# EAGLE schematic 1st_mixer_bpf_switch (EAGLE 7.2.0)
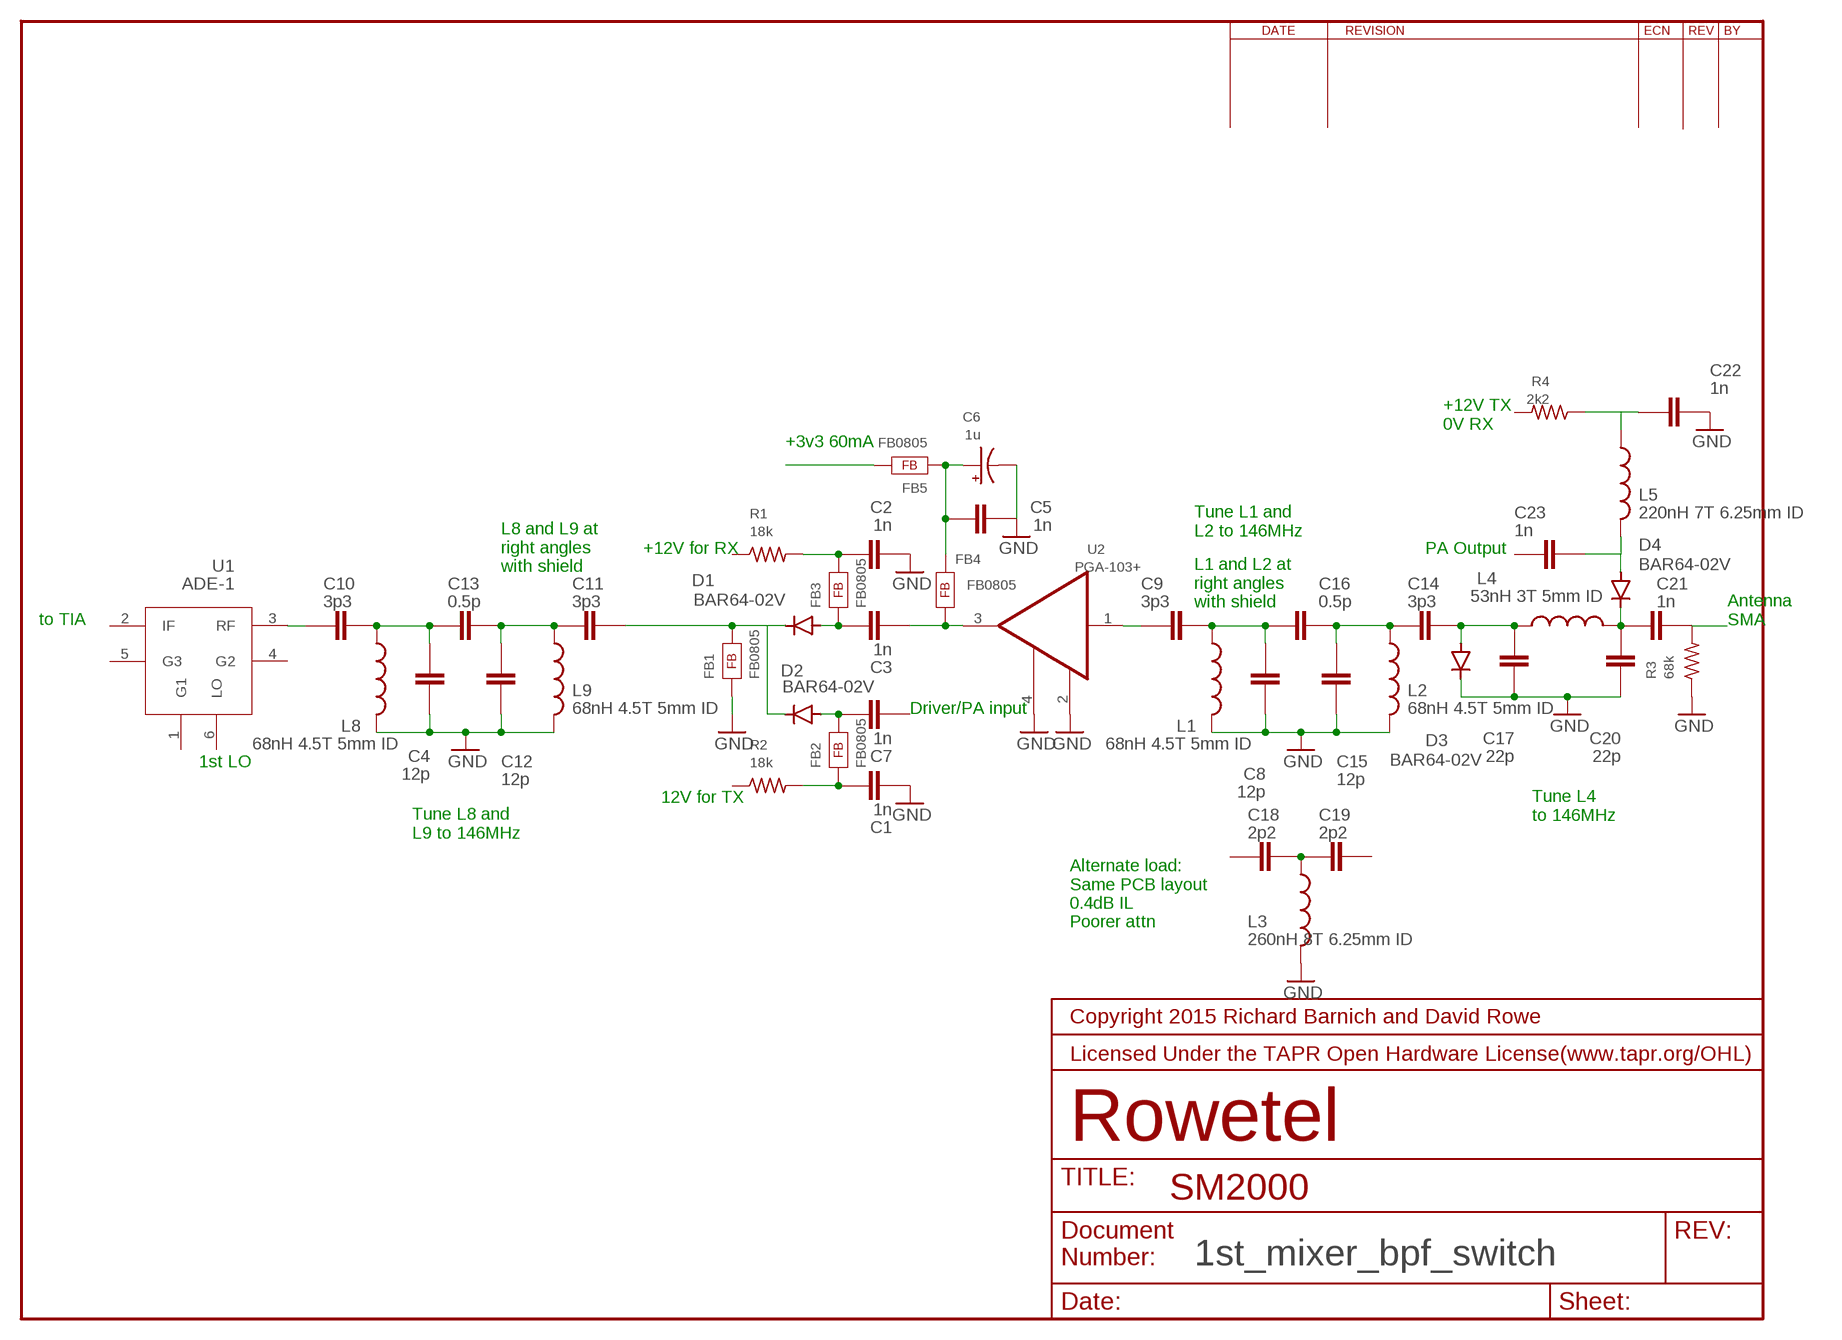
[diagram p0: schematic, sheet 1]

## Parts
C1  1n  CAPACITOR_0805  [CAPC2012X145AN]
C2  1n  CAPACITOR_0805  [CAPC2012X145AN]
C3  1n  CAPACITOR_0805  [CAPC2012X145AN]
C4  12p  CAPACITOR_0805  [CAPC2012X145AN]
C5  1n  CAPACITOR_0805  [CAPC2012X145AN]
C6  1u  CAP-TANT-1206  [C1206-TANT]
C7  1n  CAPACITOR_0805  [CAPC2012X145AN]
C8  12p  CAPACITOR_0805  [CAPC2012X145AN]
C9  3p3  CAPACITOR_0805  [CAPC2012X145AN]
C10  3p3  CAPACITOR_0805  [CAPC2012X145AN]
C11  3p3  CAPACITOR_0805  [CAPC2012X145AN]
C12  12p  CAPACITOR_0805  [CAPC2012X145AN]
C13  0.5p  CAPACITOR_0805  [CAPC2012X145AN]
C14  3p3  CAPACITOR_0805  [CAPC2012X145AN]
C15  12p  CAPACITOR_0805  [CAPC2012X145AN]
C16  0.5p  CAPACITOR_0805  [CAPC2012X145AN]
C17  22p  CAPACITOR_0805  [CAPC2012X145AN]
C18  2p2  CAPACITOR_0805  [CAPC2012X145AN]
C19  2p2  CAPACITOR_0805  [CAPC2012X145AN]
C20  22p  CAPACITOR_0805  [CAPC2012X145AN]
C21  1n  CAPACITOR_0805  [CAPC2012X145AN]
C22  1n  CAPACITOR_0805  [CAPC2012X145AN]
C23  1n  CAPACITOR_0805  [CAPC2012X145AN]
D1  BAR64-02V  [SC79_INFINEON]
D2  BAR64-02V  [SC79_INFINEON]
D3  BAR64-02V  [SC79_INFINEON]
D4  BAR64-02V  [SC79_INFINEON]
FB1  FB0805  [FE0805]
FB2  FB0805  [FE0805]
FB3  FB0805  [FE0805]
FB4  FB0805  [FE0805]
FB5  FB0805  [FE0805]
L1  68nH 4.5T 5mm ID  L-US0204/5  [0204/5]
L2  68nH 4.5T 5mm ID  L-US0204/5  [0204/5]
L3  260nH 8T 6.25mm ID  L-US0204/5  [0204/5]
L4  53nH 3T 5mm ID  L-US0204/5  [0204/5]
L5  220nH 7T 6.25mm ID  L-US0204/5  [0204/5]
L8  68nH 4.5T 5mm ID  L-US0204/5  [0204/5]
L9  68nH 4.5T 5mm ID  L-US0204/5  [0204/5]
R1  18k  RES0805  [RR0805]
R2  18k  RES0805  [RR0805]
R3  68k  RES0805  [RR0805]
R4  2k2  RES0805  [RR0805]
U1  ADE-1  [ADE-1]
U2  PGA-103+  [DF782]

## Nets
GND: C1.2 C2.2 C4.2 C5.2 C6.2 C8.2 C12.1 C15.1 C17.2 C20.2 C22.2 D3.C FB1.1 L1.2 L2.2 L3.2 L8.2 L9.2 R3.1 U2.2(GND) U2.4(GND1)
N$1: C4.1 C10.1 C13.2 L8.1
N$2: C11.2 C12.2 C13.1 L9.1
N$3: C10.2 U1.3(RF)
N$4: C2.1 FB3.2 R1.2
N$5: C1.1 FB2.1 R2.2
N$6: C3.1 D1.A FB3.1
N$7: C3.2 FB4.1 U2.3(OUT)
N$8: C5.1 C6.1 FB4.2 FB5.1
N$9: FB5.2
N$10: C7.1 D2.A FB2.2
N$11: C11.1 D1.C D2.C FB1.2
N$12: C14.1 C17.1 D3.A L4.1
N$13: C8.1 C9.1 C16.2 L1.1
N$14: C14.2 C15.2 C16.1 L2.1
N$15: C9.2
N$16: C18.1 C19.2 L3.1
N$17: C20.1 C21.2 D4.C L4.2
N$18: C21.1 R3.2
N$20: C23.1 D4.A L5.2
N$21: C22.1 L5.1 R4.1
Unconnected: C7.2 C18.2 C19.1 C23.2 R1.1 R2.1 R4.2 U1.1(G1) U1.2(IF) U1.4(G2) U1.5(G3) U1.6(LO) U2.1(1N)

## Notes on the sheet
- +12V TX
  0V RX
- +3v3 60mA
- Tune L1 and
  L2 to 146MHz
- +12V for RX | PA Output
- L8 and L9 at
  right angles
  with shield
- L1 and L2 at
  right angles
  with shield
- to TIA
- Antenna
  SMA
- Driver/PA input
- 1st LO
- 12V for TX
- Tune L4
  to 146MHz
- Tune L8 and
  L9 to 146MHz
- Alternate load:
  Same PCB layout
  0.4dB IL
  Poorer attn
- SM2000

## Library data of the parts
C1-C5 C7-C23 = AA-ipc-7351-capacitor:CAPACITOR_
C6 = _RoweTel:CAP-TANT-1206
D1-D4 = _RoweTel:BAR64-02V
FB1-FB5 = _RoweTel:FB0805
L1-L5 L8 L9 = rcl:L-US: INDUCTOR, American symbol
R1-R4 = _RoweTel:RES0805
U1 = _RoweTel:ADE-1
U2 = _RoweTel:PGA-103+